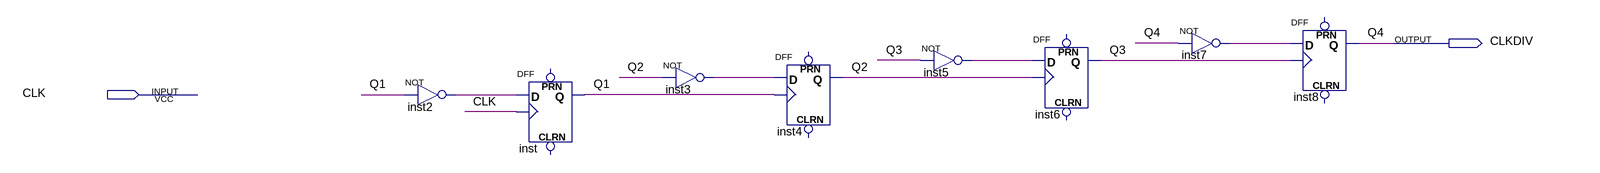
[diagram p0: schematic sheet]
// Quartus schematic CLKDivider.bdf as structural Verilog: 8 symbols, 2 pins
module CLKDivider (
  input  CLK,
  output CLKDIV
);

  wire inst2_out, inst3_out, inst5_out, inst7_out, Q1, Q2, Q3;

  not inst2 (inst2_out, Q1);
  DFF inst (.CLK(CLK), .D(inst2_out), .Q(Q1));  // open: CLRN, PRN
  not inst3 (inst3_out, Q2);
  DFF inst4 (.CLK(Q1), .D(inst3_out), .Q(Q2));  // open: CLRN, PRN
  not inst5 (inst5_out, Q3);
  DFF inst6 (.CLK(Q2), .D(inst5_out), .Q(Q3));  // open: CLRN, PRN
  not inst7 (inst7_out, CLKDIV);
  DFF inst8 (.CLK(Q3), .D(inst7_out), .Q(CLKDIV));  // open: CLRN, PRN

  // Other names for the same wires on the sheet: Q4 = CLKDIV
endmodule
